# Altium schematic sheet Polos y Ceros.SchDoc
size A4
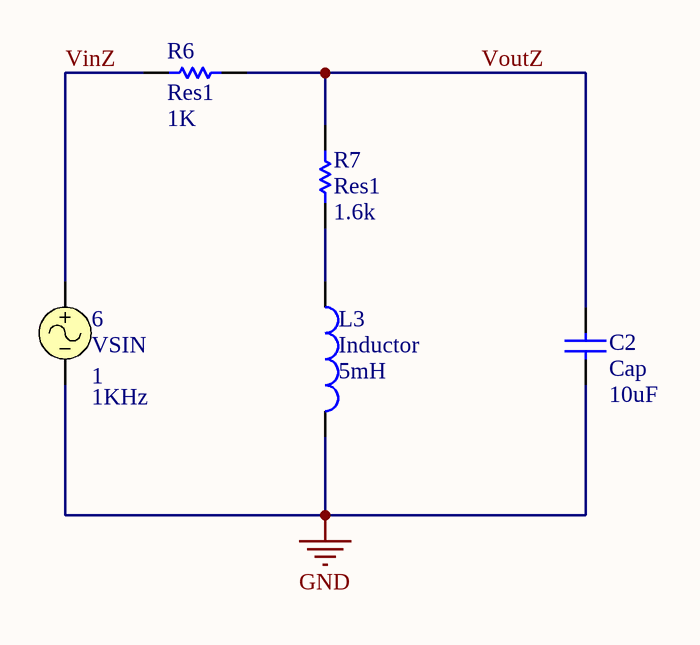
[diagram p0: Polos y Ceros.SchDoc]

## Parts
6  VSIN  Amplitude: 1  Frequency: 1KHz
C2  Cap  value 10uF  [RAD-0.3]
L3  Inductor  value 5mH  [0402-A]
R6  Res1  value 1K  [AXIAL-0.3]
R7  Res1  value 1.6k  [AXIAL-0.3]

## Nets
GND: 6.2 C2.1 L3.2
VinZ: 6.1 R6.1
VoutZ: C2.2 R6.2 R7.1
NetL3_1: L3.1 R7.2

## Library data of the parts
6 = VSIN: Sinusoidal Voltage Source; Note: PCB Footprint - Not required; Published: 8-Jun-2000; LatestRevisionDate: 15-Nov-2004; LatestRevisionNote: Corrected Netlist.; PackageReference: Not Applicable; Publisher: Altium Limited
C2 = Cap: Capacitor; Published: 8-Jun-2000; LatestRevisionDate: 17-Jul-2002; LatestRevisionNote: Re-released for DXP Platform.; PackageReference: RAD-0.3; Publisher: Altium Limited; PackageDescription: Radial Cap, Thru-Hole; 2 Leads; 0.3 in Pin Spacing
L3 = Inductor: Code_IEC: 1005; Published: 8-Jun-2000; LatestRevisionDate: 29-May-2009; LatestRevisionNote: IPC-7351 Footprint Added.; PackageReference: 0402-A; Publisher: Altium Limited; PackageDescription: Chip Inductor; Code_JEITA: 0402
R6 R7 = Res1: Resistor; Published: 8-Jun-2000; LatestRevisionDate: 17-Jul-2002; LatestRevisionNote: Re-released for DXP Platform.; PackageReference: AXIAL-0.3; Publisher: Altium Limited; PackageDescription: Axial Device, Thru-Hole; 2 Leads; 0.3 in Pin Spacing